# EAGLE design transistor-h-bridge (EAGLE 6.4)
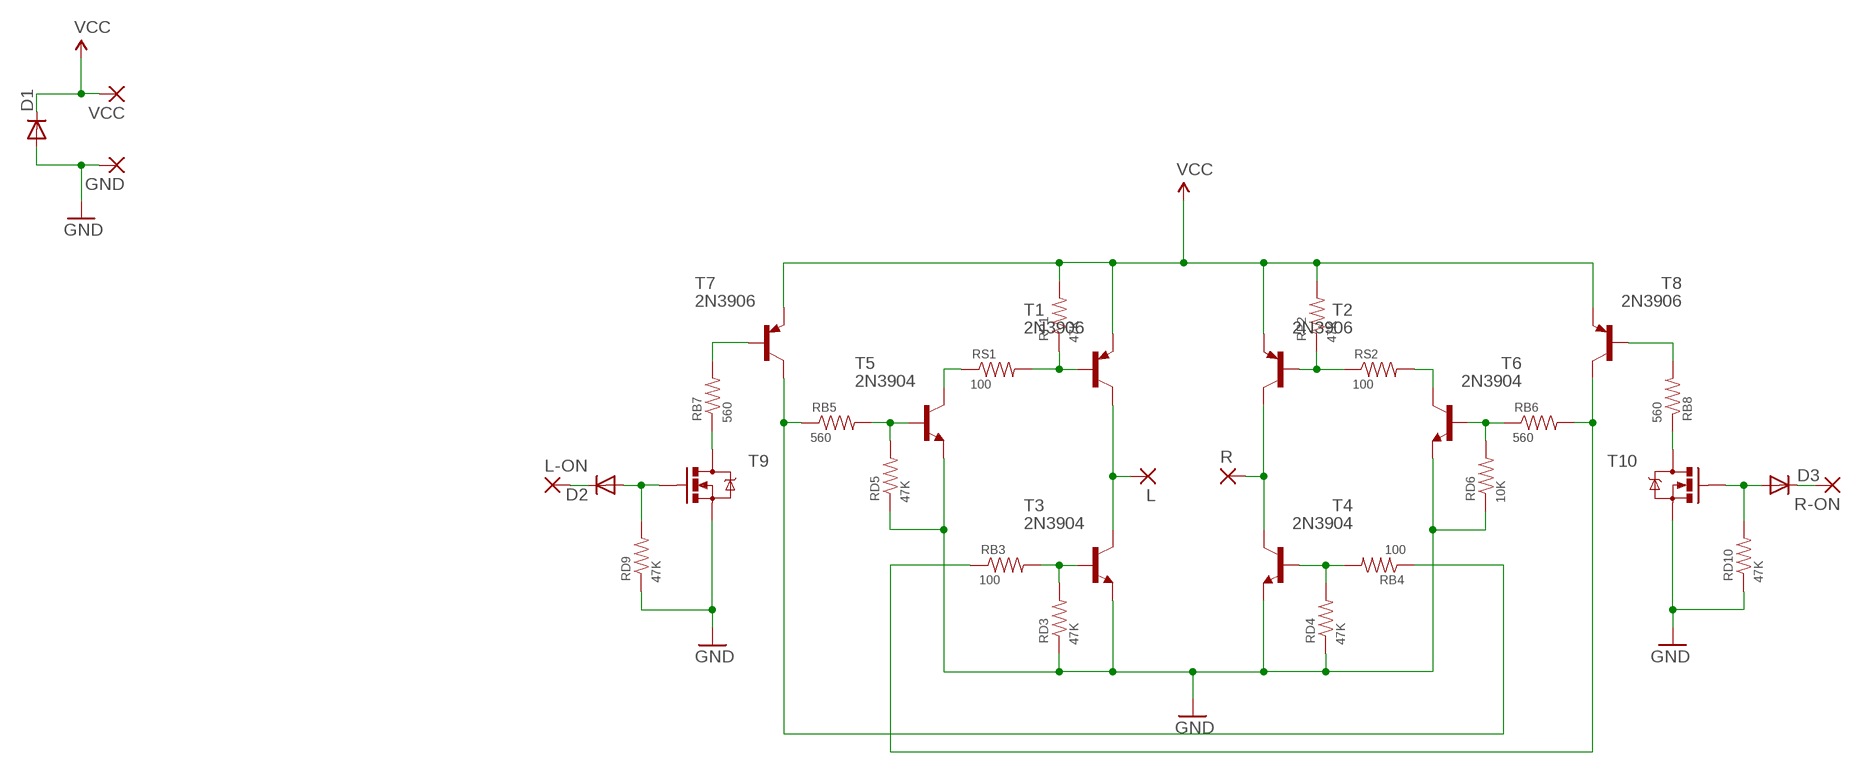
[diagram p0: schematic, sheet 1]

## Parts
D1  DIODE1N4148  [DIODE-1N4148]
D2  DIODE1N4148  [DIODE-1N4148]
D3  DIODE1N4148  [DIODE-1N4148]
GND  WIREPAD2,54/0,8  [2,54/0,8]
L  WIREPAD2,54/0,8  [2,54/0,8]
L-ON  WIREPAD2,54/0,8  [2,54/0,8]
R  WIREPAD2,54/0,8  [2,54/0,8]
R-ON  WIREPAD2,54/0,8  [2,54/0,8]
RB3  100  RESISTOR-PTH  [VERT-PTH]
RB4  100  RESISTOR-PTH  [VERT-PTH]
RB5  560  RESISTOR-PTH  [VERT-PTH]
RB6  560  RESISTOR-PTH  [VERT-PTH]
RB7  560  RESISTOR-PTH  [VERT-PTH]
RB8  560  RESISTOR-PTH  [VERT-PTH]
RD3  47K  RESISTOR-PTH  [VERT-PTH]
RD4  47K  RESISTOR-PTH  [VERT-PTH]
RD5  47K  RESISTOR-PTH  [VERT-PTH]
RD6  10K  RESISTOR-PTH  [VERT-PTH]
RD9  47K  RESISTOR-PTH  [VERT-PTH]
RD10  47K  RESISTOR-PTH  [VERT-PTH]
RP1  47K  RESISTOR-PTH  [VERT-PTH]
RP2  47K  RESISTOR-PTH  [VERT-PTH]
RS1  100  RESISTOR-PTH  [VERT-PTH]
RS2  100  RESISTOR-PTH  [VERT-PTH]
T1  2N3906  [TO92]
T2  2N3906  [TO92]
T3  2N3904  [TO92]
T4  2N3904  [TO92]
T5  2N3904  [TO92]
T6  2N3904  [TO92]
T7  2N3906  [TO92]
T8  2N3906  [TO92]
T9  MOSFET-NCHANNELPTH  [TO-92]
T10  MOSFET-NCHANNELPTH  [TO-92]
VCC  WIREPAD2,54/0,8  [2,54/0,8]

## Nets
GND: D1.A GND.1(P) RD3.1(G$1) RD4.1(G$1) RD5.1(G$1) RD6.1(G$1) RD9.1(G$1) RD10.1(G$1) T3.3(E) T4.3(E) T5.3(E) T6.3(E) T9.2(S) T10.2(S)
N$1: RP1.1(G$1) RS1.2(G$2) T1.2(B)
N$2: RP2.1(G$1) RS2.1(G$1) T2.2(B)
N$3: RB6.1(G$1) RD6.2(G$2) T6.2(B)
N$4: D2.A RD9.2(G$2) T9.3(G)
N$5: RB5.2(G$2) RD5.2(G$2) T5.2(B)
N$6: RB4.1(G$1) RB5.1(G$1) T7.1(C)
N$7: RB4.2(G$2) RD4.2(G$2) T4.2(B)
N$8: RB3.1(G$1) RB6.2(G$2) T8.1(C)
N$9: RB3.2(G$2) RD3.2(G$2) T3.2(B)
N$10: RB7.2(G$2) T7.2(B)
N$11: RB8.2(G$2) T8.2(B)
N$12: RB7.1(G$1) T9.1(D)
N$13: L.1(P) T1.1(C) T3.1(C)
N$14: R.1(P) T2.1(C) T4.1(C)
N$15: RS1.1(G$1) T5.1(C)
N$16: RS2.2(G$2) T6.1(C)
N$17: D3.A RD10.2(G$2) T10.3(G)
N$18: RB8.1(G$1) T10.1(D)
N$19: D2.C L-ON.1(P)
N$20: D3.C R-ON.1(P)
VCC: D1.C RP1.2(G$2) RP2.2(G$2) T1.3(E) T2.3(E) T7.3(E) T8.3(E) VCC.1(P)

## Library data of the parts
D1-D3 = SparkFun-DiscreteSemi:DIODE: Diode These are standard reverse protection diodes and small signal diodes. SMA package can handle up to about 1A. SOD-323 can handle about 200mA. What the SOD-323 package when ordering, there are some mfgs out there that are 5-pin packages.
GND L L-ON R R-ON VCC = wirepad:WIREPAD: Wire PAD connect wire on PCB
RB3-RB8 RD3-RD6 RD9 RD10 RP1 RP2 RS1 RS2 = Synapseware:RESISTOR-PTH
T1 T2 T7 T8 = transistor-pnp:2N3906: PNP Transistor
T3-T6 = transistor:2N3904: NPN TRANSISTOR
T9 T10 = SparkFun-DiscreteSemi:MOSFET-NCHANNEL: Generic NMOS footprint

## Board
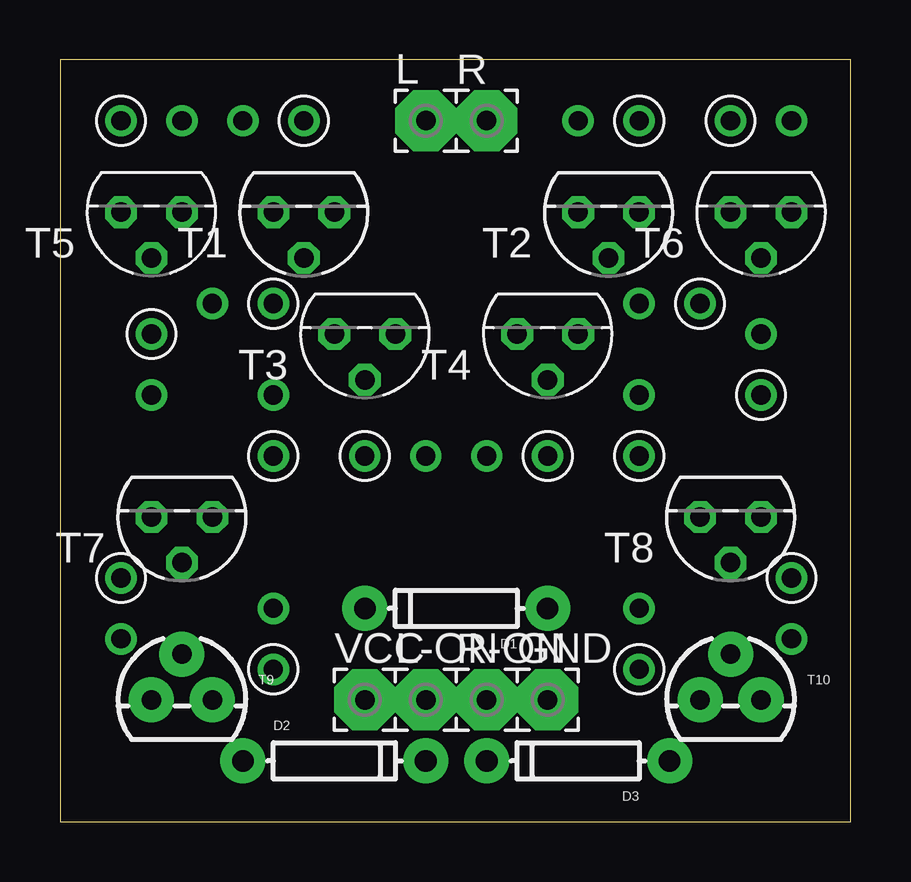
[diagram p1: board, top side]
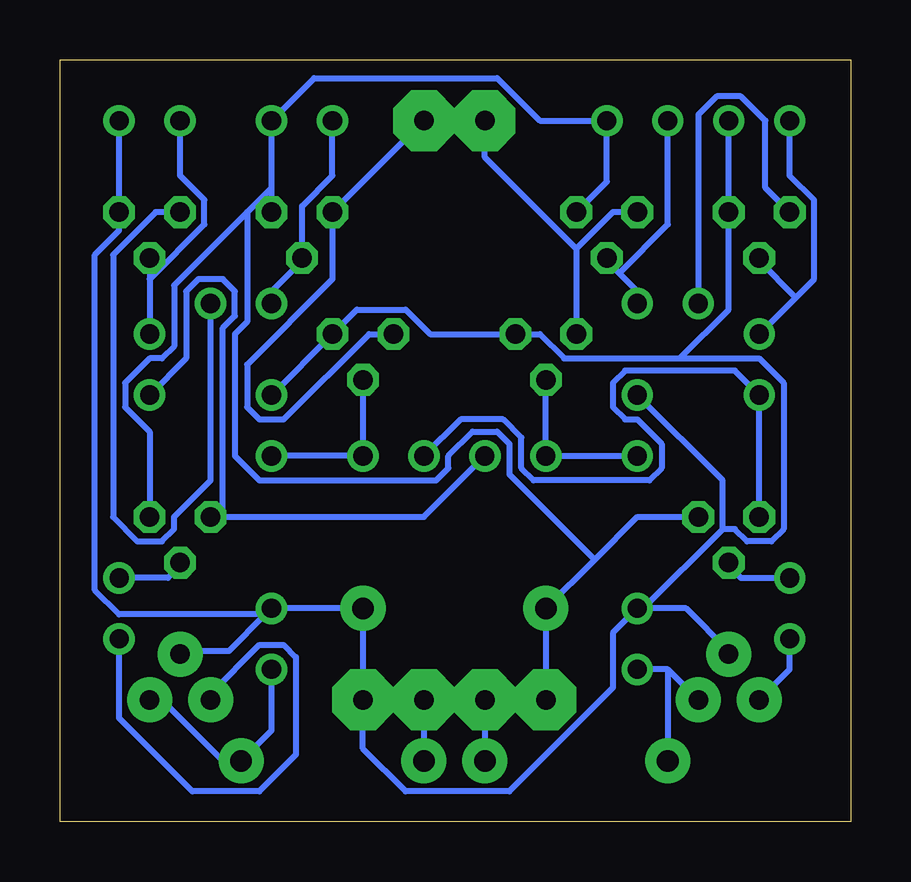
[diagram p2: board, bottom side, seen from below]

Size 32.94 x 31.74 mm. Coordinates in mm from the lower left corner, seen from the top.
Outline: 0,0 32.94,0 32.94,31.74 0,31.74 0,0
Copper layers (1*16): Top 0.035mm / dielectric 1.5mm / Bottom 0.035mm
Design rules "default": minimum track width 10mil, minimum drill 24mil, track to track 8mil, track to pad 8mil, pad to pad 8mil, via to via 8mil, smd to smd 8mil, copper to edge 40mil, drill to drill 8mil, minimum pad ring 10mil, minimum via ring 8mil, stop-mask expansion 4mil, vias tented up to drill 0mil, thermal gap 10mil

### Footprints (pad centres in the part's own frame; a part is rotated, then mirrored left to right if it is on the bottom)
DIODE-1N4148 = drill 0.9 pad 1.88: A -3.81,0; C 3.81,0
2,54/0,8 = drill 0.813 pad 2.54 octagon: 1 0,0
VERT-PTH = drill 0.8: 1 -1.27,0; 2 1.27,0
TO92 = drill 0.813 octagon: 1 1.27,0; 2 0,1.905; 3 -1.27,0
TO-92 = drill 0.813 pad 1.88: 1 -1.27,0; 2 0,1.905; 3 1.27,0

### Placement (x,y rotation side)
D1  16.51,8.89 180 top
D2  11.43,2.54 0 top
D3  21.59,2.54 180 top
GND  20.32,5.08 0 top
L  15.24,29.21 0 top
L-ON  15.24,5.08 0 top
R  17.78,29.21 0 top
R-ON  17.78,5.08 0 top
RB3  13.97,15.24 180 top
RB4  19.05,15.24 0 top
RB5  3.81,19.05 90 top
RB6  29.21,19.05 270 top
RB7  2.54,8.89 90 top
RB8  30.48,8.89 90 top
RD3  8.89,16.51 270 top
RD4  24.13,16.51 270 top
RD5  3.81,29.21 180 top
RD6  29.21,29.21 180 top
RD9  8.89,7.62 270 top
RD10  24.13,7.62 270 top
RP1  8.89,29.21 0 top
RP2  22.86,29.21 0 top
RS1  7.62,21.59 0 top
RS2  25.4,21.59 0 top
T1  10.16,25.4 180 top
T2  22.86,25.4 180 top
T3  12.7,20.32 180 top
T4  20.32,20.32 180 top
T5  3.81,25.4 180 top
T6  29.21,25.4 180 top
T7  5.08,12.7 180 top
T8  27.94,12.7 180 top
T9  5.08,5.08 0 top
T10  27.94,5.08 0 top
VCC  12.7,5.08 0 top

### Tracks (layer width: path | path; a pad name or v marks a point on that pad's centre or on a via)
GND
  Bottom 0.254: RD6.1 T6.3 30.48,24.64 31.5,23.62 31.5,9.65 30.48,8.64 24.38,8.64 | 24.38,8.64 25.91,7.11 27.94,7.11 T10.2 | 24.38,8.64 RD10.1 D1.A GND.1 20.32,3.05 18.54,1.27 14.22,1.27 9.91,5.59 9.91,7.87 RD9.1 8.64,8.89 | 8.64,8.89 6.86,8.89 5.08,7.11 T9.2 | RD3.1 5.33,14.22 5.33,12.19 | 8.64,8.89 5.33,12.19 | RD5.1 T5.3 5.08,21.34 7.11,19.3 | RD4.1 T4.3 20.57,21.34 18.54,21.34 17.53,20.32 T3.3 12.95,20.32 11.94,19.3 7.11,19.3 | 5.33,12.19 4.83,12.19 4.32,11.68 3.3,11.68 2.79,12.19 2.79,18.29 3.81,19.3 7.11,19.3
N$1
  Bottom 0.254: RS1.2 8.89,22.1 9.65,22.86 | 9.65,22.86 10.16,23.37 T1.2 | RP1.1 7.62,24.89 9.65,22.86
N$2
  Bottom 0.254: RS2.1 24.13,22.1 22.86,23.37 T2.2 22.86,25.65 21.59,26.92 RP2.1
N$3
  Bottom 0.254: T6.2 29.21,22.61 | 29.21,22.61 RB6.1 | RD6.2 27.94,26.92 26.92,25.91 26.92,24.89 29.21,22.61
N$4
  Bottom 0.254: 7.62,6.35 RD9.2 | T9.3 7.62,6.35 | 7.62,6.35 D2.A
N$5
  Bottom 0.254: RD5.2 2.54,26.92 1.52,25.91 1.52,22.61 2.29,21.84 | RB5.2 2.29,21.84 | 2.29,21.84 3.81,23.37 T5.2
N$6
  Bottom 0.254: T7.1 RB5.1 4.83,18.8 9.4,18.8 9.91,18.29 9.91,17.27 9.4,16.76 8.89,16.76 7.87,15.75 7.87,14.73 8.38,14.22 13.21,14.22 13.72,14.73 13.72,16 14.48,16.76 16.26,16.76 RB4.1
N$7
  Bottom 0.254: T4.2 RB4.2 RD4.2
N$8
  Bottom 0.254: RB3.1 17.78,12.7 26.16,12.7 | RB6.2 27.69,19.3 27.69,22.1 27.18,22.61 26.16,22.61 25.65,22.1 25.65,21.08 26.16,20.57 26.16,12.7 | 26.16,12.7 T8.1
N$9
  Bottom 0.254: RD3.2 RB3.2 T3.2
N$10
  Bottom 0.254: RB7.2 4.57,10.16 5.08,10.67 T7.2
N$11
  Bottom 0.254: RB8.2 28.45,10.16 27.94,10.67 T8.2
N$12
  Bottom 0.254: RB7.1 2.54,6.35 T9.1
N$13
  Bottom 0.254: 11.43,23.88 T3.1 | 11.43,23.88 9.91,25.4 T1.1 | L.1 15.24,27.69 11.43,23.88
N$14
  Bottom 0.254: T4.1 20.07,20.32 23.62,16.76 24.64,16.76 25.15,17.27 25.15,19.05 21.59,22.61 T2.1 R.1
N$15
  Bottom 0.254: RS1.1 6.35,29.46 5.59,30.23 4.57,30.23 3.56,29.21 3.56,26.42 T5.1
N$16
  Bottom 0.254: RS2.2 26.67,14.22 28.19,12.7 28.19,12.19 28.7,11.68 29.72,11.68 30.73,12.7 30.73,23.62 28.96,25.4 T6.1
N$17
  Bottom 0.254: RD10.2 24.13,3.81 D3.A 26.16,2.54 28.7,5.08 T10.3
N$18
  Bottom 0.254: RB8.1 30.48,4.32 27.43,1.27 24.64,1.27 23.11,2.79 23.11,6.86 23.62,7.37 24.64,7.37 26.67,5.33 T10.1
N$19
  Bottom 0.254: L-ON.1 D2.C
N$20
  Bottom 0.254: R-ON.1 D3.C
VCC
  Bottom 0.254: T7.3 8.89,12.7 10.67,10.92 | 10.67,10.92 D1.C VCC.1 | T1.3 10.16,26.67 RP1.2 12.95,29.21 14.73,30.99 22.35,30.99 RP2.2 24.13,26.42 | T2.3 24.13,26.42 | T8.3 29.21,16.26 30.23,17.27 30.23,18.29 29.21,19.3 28.7,19.3 28.19,19.81 28.19,22.35 25.15,25.4 | 24.13,26.42 25.15,25.4 | 10.67,10.92 14.22,14.48 14.22,15.75 14.73,16.26 15.75,16.26 16.76,15.24 16.76,14.73 17.27,14.22 24.64,14.22 25.65,15.24 25.65,20.32 25.15,20.83 25.15,25.4